# Altium schematic sheet Sheet2.SchDoc
size B; SheetNumber: 1; SheetTotal: 1
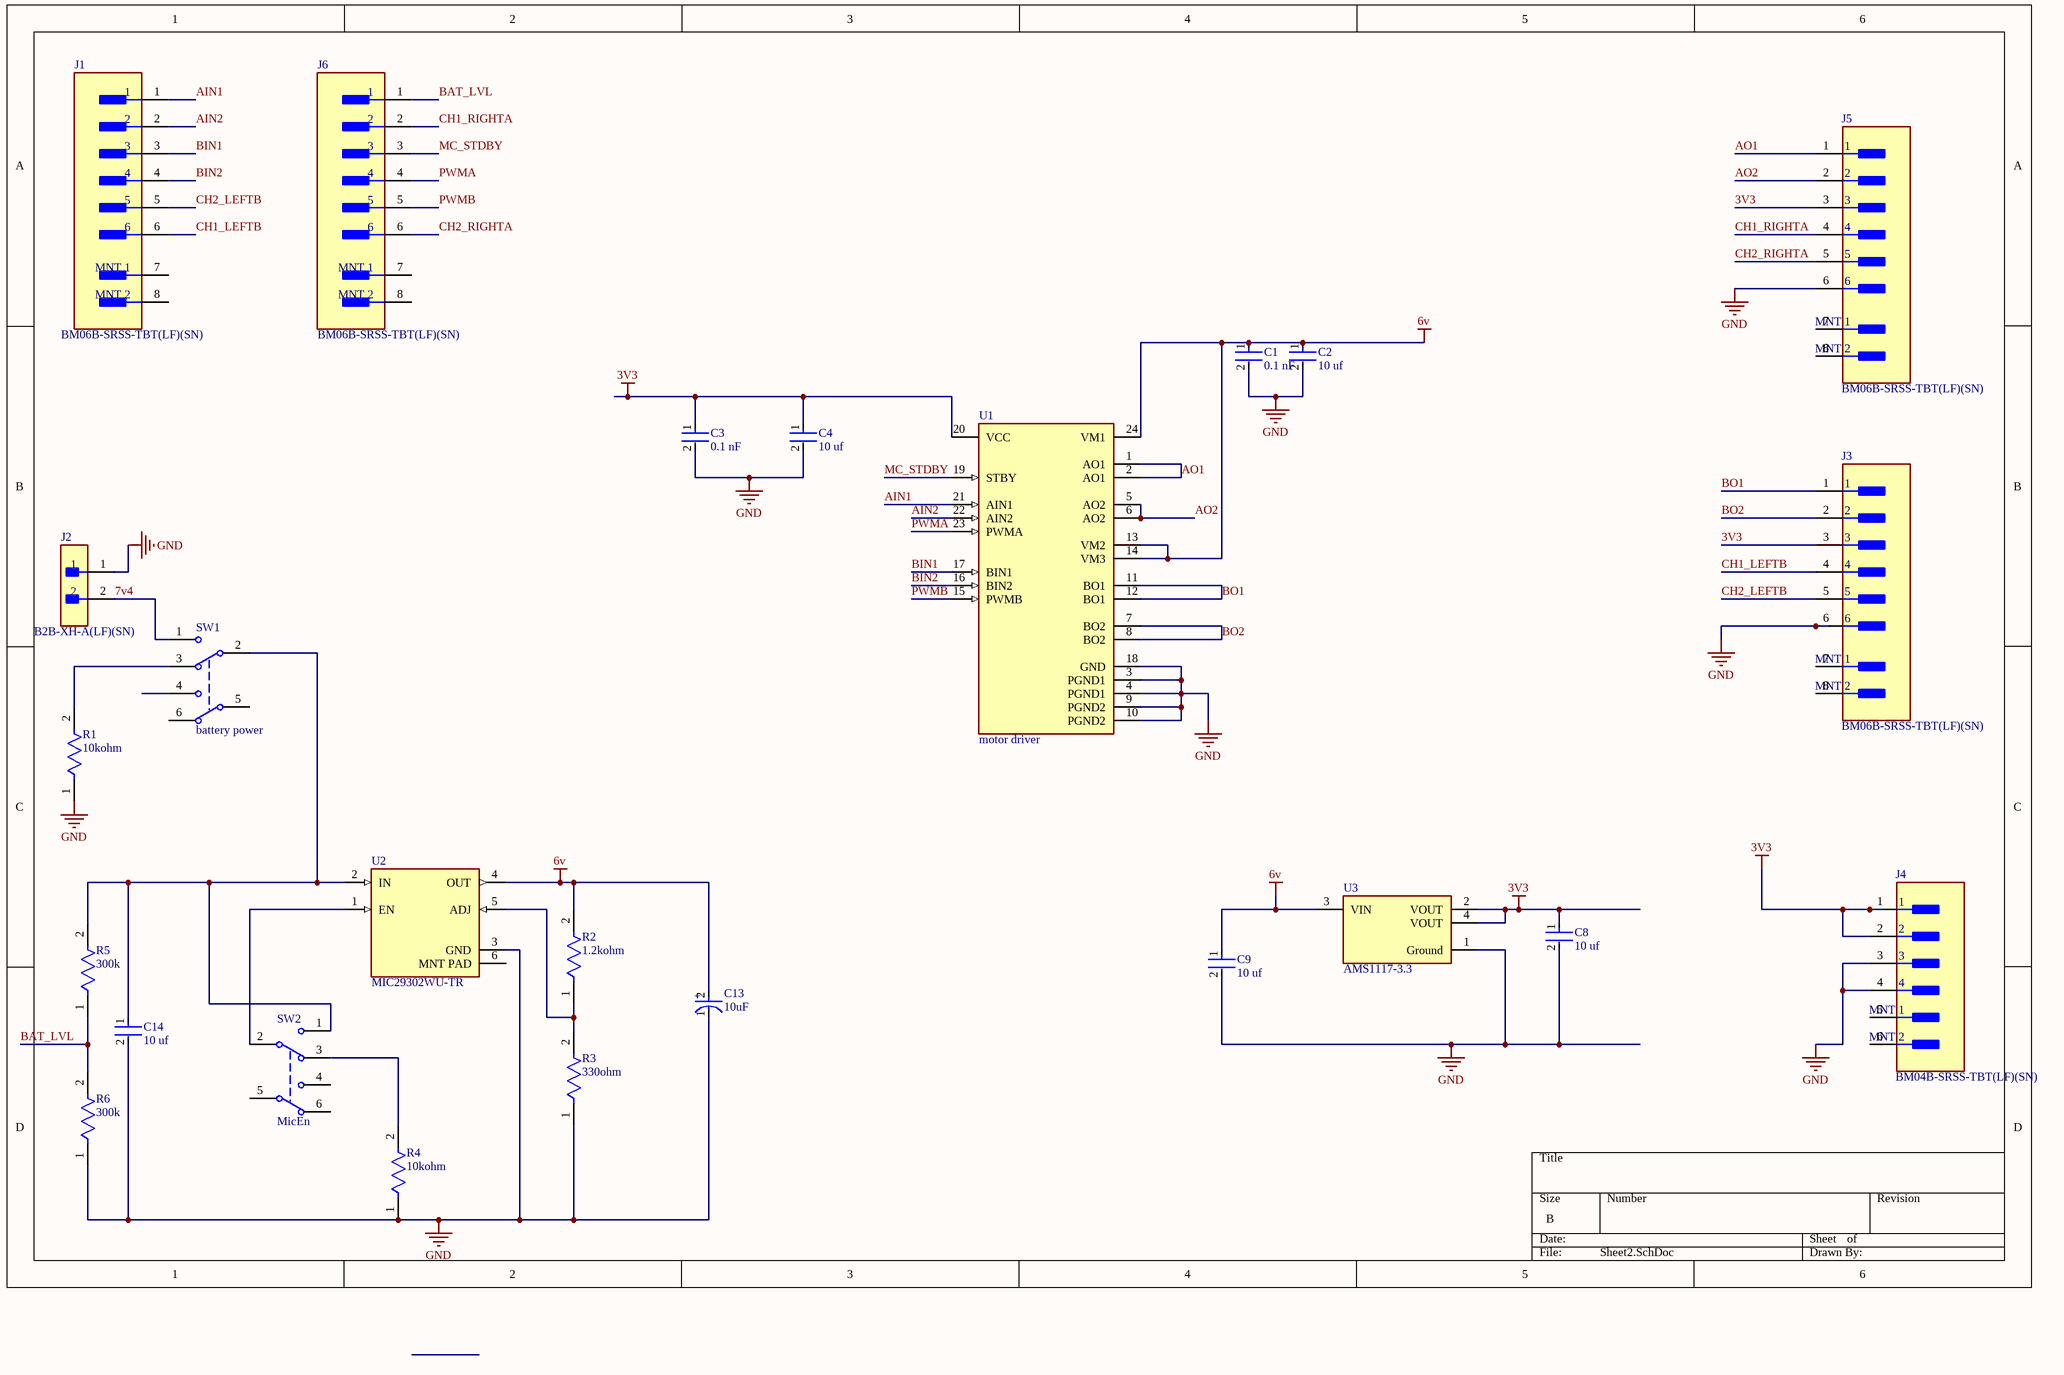
[diagram p0: Sheet2.SchDoc]

## Parts
C1  0.1 nF  [FP-CC0805-0_85-MFG]
C2  10 uf  [FP-CC0805-0_2-1_45-IPC_A]
C3  0.1 nF  [FP-CC0805-0_85-MFG]
C4  10 uf  [FP-CC0805-0_2-1_45-IPC_A]
C8  10 uf  [FP-CC0805-0_2-1_45-IPC_A]
C9  10 uf  [FP-CC0805-0_2-1_45-IPC_A]
C13  10uF  [FP-T491A105K016AT-MFG]
C14  10 uf  [FP-CC0805-0_2-1_45-IPC_A]
J1  BM06B-SRSS-TBT(LF)(SN)  [FP-BM06B-SRSS-TBT_LF_SN-MFG]
J2  B2B-XH-A(LF)(SN)  [FP-B2B-XH-A_LF_SN-MFG]
J3  BM06B-SRSS-TBT(LF)(SN)  [FP-BM06B-SRSS-TBT_LF_SN-MFG]
J4  BM04B-SRSS-TBT(LF)(SN)  [FP-BM04B-SRSS-TBT_LF_SN-MFG]
J5  BM06B-SRSS-TBT(LF)(SN)  [FP-BM06B-SRSS-TBT_LF_SN-MFG]
J6  BM06B-SRSS-TBT(LF)(SN)  [FP-BM06B-SRSS-TBT_LF_SN-MFG]
R1  10kohm  [FP-CR0805-IPC_B]
R2  1.2kohm  [FP-CR0805-IPC_B]
R3  330ohm  [FP-CR0805-IPC_B]
R4  10kohm  [FP-CR0805-IPC_B]
R5  300k  [FP-CR0805-IPC_B]
R6  300k  [FP-CR0805-IPC_B]
SW1  battery power  [452404020202]
SW2  MicEn  [452404020202]
U1  motor driver  [FP-SSOP24-P-300-0_65A-IPC_A]
U2  MIC29302WU-TR  [FP-C04-012-MFG]
U3  AMS1117-3.3  [FP-AMS1117-IPC_C]

## Nets
3V3: C3.1 C4.1 C8.1 J3.3 J4.1 J4.2 J5.3 U1.20(VCC) U3.2(VOUT) U3.4(VOUT)
6v: C1.1 C2.1 C9.1 C13.2(A) R2.2 U1.13(VM2) U1.14(VM3) U1.24(VM1) U2.4(OUT) U3.3(VIN)
GND: C1.2 C2.2 C3.2 C4.2 C8.2 C9.2 C13.1(C) C14.2 J2.1 J3.6 J4.3 J4.4 J5.6 R1.1 R3.1 R4.1 R6.1 U1.3(PGND1) U1.4(PGND1) U1.9(PGND2) U1.10(PGND2) U1.18(GND) U2.3(GND) U3.1(Ground)
7v4: J2.2 SW1.1
AIN1: J1.1 U1.21(AIN1)
AIN2: J1.2 U1.22(AIN2)
AO1: J5.1 U1.1(AO1) U1.2(AO1)
AO2: J5.2 U1.5(AO2) U1.6(AO2)
BAT_LVL: J6.1 R5.1 R6.2
BIN1: J1.3 U1.17(BIN1)
BIN2: J1.4 U1.16(BIN2)
BO1: J3.1 U1.11(BO1) U1.12(BO1)
BO2: J3.2 U1.7(BO2) U1.8(BO2)
CH1_LEFTB: J1.6 J3.4
CH1_RIGHTA: J5.4 J6.2
CH2_LEFTB: J1.5 J3.5
CH2_RIGHTA: J5.5 J6.6
MC_STDBY: J6.3 U1.19(STBY)
PWMA: J6.4 U1.23(PWMA)
PWMB: J6.5 U1.15(PWMB)
NetC14_1: C14.1 R5.2 SW1.2 SW2.1 U2.2(IN)
NetR1_2: R1.2 SW1.3
NetR2_1: R2.1 R3.2 U2.5(ADJ)
NetR4_2: R4.2 SW2.3
NetSW2_2: SW2.2 U2.1(EN)

Not connected (* = marked no-connect by the designer): J1 7(MNT_1) 8(MNT_2); J3 7(MNT_1) 8(MNT_2); J4 5(MNT_1) 6(MNT_2); J5 7(MNT_1) 8(MNT_2); J6 7(MNT_1) 8(MNT_2); SW1 4 5 6; SW2 4 5 6; U2 6(MNT_PAD)

## Notes on the sheet
- (in symbol CMP-2000-07186-2) +

## Library data of the parts
C1 C3 = CMP-2100-03606-3: CAP CER 0.1UF 50V X7R 0805; Manufacturer Part Number: CC0805KRX7R9BB104; Manufacturer: Yageo; Tolerance: 0.1; Capacitance: 100 nF; Value: 100 nF; Material: Ceramic; Device Class L1: Passive Components; ComponentLink2Description: Datasheet; Package: CC0805-0.85; Digikey Description: CAP CER 0.1UF 50V X7R 0805; Device Class L3: Ceramic Capacitors; Temperature: -30°C to +85°C; Temperature Characteristic: X7R; Voltage Rating: 50 V; Height: 0.95mm; RoHS: TRUE; Ipc Land Pattern Name: CAPC200125X85; Device Class L2: Capacitors; Category: Cap; Temperature Range Low: -30°C; Temperature Range High: +85°C; Mouser Description: Multilayer Ceramic Capacitors MLCC - SMD/SMT 100nF 50V X7R 10%; Footprint Url: http://www.yageo.com/exep/pages/download/literatures/UPY-C_GEN_24.pdf; Automotive: No; Octopart: https://octopart.com/cc0805krx7r9bb104-yageo-192993; Lead Free: Yes; ComponentLink2URL: http://www.yageo.com/documents/recent/UPY-GPHC_Y5V_6.3V-to-50V_8.pdf
C2 C4 C8 C9 C14 = CMP-1036-04922-3: CAP CER 10UF 10V X5R 0805; Tolerance: 10%; Dissipation Factor: 15%; Voltage Rating: 10V; Case/Package: 0805; Series: CC; Package Quantity: 1; Max Operating Temperature: 85°C; Min Operating Temperature: -55°C; Radiation Hardening: No; Termination: SMD/SMT; Voltage Rating (DC): 10V; Width: 0.049inch; Height: 0.85mm; Packaging: Tape and Reel; Voltage: 10V; Halogen Free: Halogen Free; Lead Free: Lead Free; Case Code (Imperial): 0805; Resistor Type: Ceramic; Length: 2mm; Construction: Flat; Mount: Surface Mount; Capacitance: 10uF; Depth: 1.25mm; Number of Pins: 2; Dielectric: X5R; RoHS Compliant: Yes; Case Code (Metric): 2012
C13 = CMP-2000-07186-2: CAP TANT 1UF 10% 16V 1206; Tolerance: 20%; Ripple Current: 87mA; Dielectric Material: Tantalum; Life (Hours): 2000Hour; Dissipation Factor: 4%; ESR (Equivalent Series Resistance): 10R; Leakage Current: 500nA; Polarity: Polar; Lead Free: Lead Free; Capacitance: 1uF; Min Operating Temperature: -55°C; Number of Pins: 2; Mount: Surface Mount; Voltage: 16V; Voltage Rating: 16V; Case Code (Imperial): 1206; Length: 3.2mm; Height: 1.6mm; Features: General Purpose; Max Operating Temperature: 125°C; Package Quantity: 1; REACH SVHC: No SVHC; Termination: SMD/SMT; Depth: 1.6mm; Width: 1.6mm; Packaging: Tape and Reel; Case Code (Metric): 3216; Case/Package: 1206; Voltage Rating (DC): 16V; Height - Seated (Max): 0.071inch
J1 J3 J5 J6 = CMP-17439-000255-1: CONN HEADER SMD 6POS 1MM; Voltage Rating: 50V; Number of Positions: 6; Current Rating: 1A; Gender: Male; Contact Resistance: 20mR; Insulation Resistance: 100MR; Mated Stacking Heights: 4.9mm; Number of Rows: 1; Contact Type: Male Pin; Pitch: 1mm; Length: 8mm; Max Operating Temperature: 85°C; Mount: Surface Mount; Material: Polyamide; Depth: 3.6mm; Housing Color: Natural; Orientation: Straight; Termination: Solder; Package Quantity: 1; Min Operating Temperature: -25°C; Contact Shape: Square; Insulation Color: Natural; Connector Type: Header; Max Voltage Rating (DC): 50V; Insulation Material: Nylon; Flammability Rating: UL94 V-0; Color: Natural; Contact Plating: Tin; Lead Free: Lead Free; Packaging: Tape and Reel; Contact Material: Copper Alloy; Series: SR; Housing Material: Polyamide; Contact Finish - Mating: TIN; Max Voltage Rating (AC): 50V; Fastening Type: Pull; Max Current Rating: 1A
J2 = CMP-2000-05888-3: CONN HEADER VERT 2POS 2.5MM; Current Rating: 3A; Voltage Rating: 250V; Number of Contacts: 2; Contact Resistance: 20mR; Wire/Cable Gauge: 22AWG; Insulation Resistance: 1GR; Connector Type: Male Pin; Packaging: Bulk; Contact Material: Brass; Lead Free: Lead Free; Orientation: Straight; Contact Plating: Tin; Max Current Rating: 3A; Termination: Solder; Fastening Type: Detent; Depth: 5.75mm; Housing Material: Polyamide; REACH SVHC: No SVHC; Series: XH; Voltage Rating (AC): 250V; Number of Positions: 2; Color: Natural; Contact Type: Male Pin; Max Voltage Rating (DC): 250V; Pitch: 2.5mm; Lead Pitch: 2.5mm; Mount: Through Hole; Max Operating Temperature: 85°C; Length: 7.4mm; Max Voltage Rating (AC): 250V; Min Operating Temperature: -25°C; Number of Rows: 1; Housing Color: White
J4 = CMP-17439-000370-1: CONN HEADER SMD 4POS 1MM; Voltage Rating: 50V; Number of Positions: 4; Pitch: 0.039inch; Mated Stacking Heights: 4.9mm; Packaging: Cut Tape; Contact Material: Copper Alloy; Lead Free: Lead Free; Contact Type: Male Pin; Fastening Type: Pull; Connector Type: Header; Contact Finish - Mating: TIN; Series: SR; Number of Rows: 1; Contact Shape: Square; Package Quantity: 1; Color: Natural; Flammability Rating: UL94 V-0; Mount: Surface Mount; Insulation Color: Natural; Termination: Solder; Contact Plating: Tin; Insulation Material: Nylon
R1 R4-R6 = CMP-07231-003873-1: Thick Film Chip Resistors 0805 10kΩ 0.125W 5% 200ppm/°C; Resistance: 10kR; Power Rating: 125mW; Voltage Rating (DC): 100V; Voltage Rating: 150V; Width: 1.25mm; Composition: Thick Film; Packaging: Tape and Reel; Number of Terminations: 2; Min Operating Temperature: -55°C; Height: 0.5mm; Temperature Coefficient: 200ppm/°C; Features: Moisture Resistant; Termination: SMD/SMT; Case Code (Imperial): 0805; Package Quantity: 1; Radiation Hardening: No; Military Standard: Not; Thickness: 508um; Depth: 1.25mm; Tolerance: 5%; Contact Plating: Tin; Number of Pins: 2; Length: 2mm; Max Power Dissipation: 125mW; Mount: Surface Mount; Case Code (Metric): 2012; Case/Package: 0805; REACH SVHC: No SVHC; Max Operating Temperature: 155°C
R2 = CMP-07231-005482-1: Thick Film Chip Resistors 0805 1kΩ 0.125W 1% 100ppm/°C; Max Power Dissipation: 125mW; Voltage Rating: 150V; Resistance: 1kR; Package Quantity: 1; Contact Plating: Tin; Length: 2mm; Number of Terminations: 2; Max Operating Temperature: 155°C; Depth: 1.25mm; REACH SVHC: No SVHC; Case Code (Imperial): 0805; Termination: SMD/SMT; Min Operating Temperature: -55°C; Case Code (Metric): 2012; Width: 1.25mm; Packaging: Tape and Reel; Case/Package: 0805; Height: 0.5mm; Radiation Hardening: No; Thickness: 508um; Temperature Coefficient: 100ppm/°C; Mount: Surface Mount; Features: Moisture Resistant; Voltage Rating (DC): 150V; Composition: Thick Film; Power Rating: 125mW; Number of Pins: 2; Tolerance: 1%
R3 = CMP-1013-00454-2: Thick Film Chip Resistors 0805 330Ω 0.125W 1% 100ppm/°C; Voltage Rating: 150V; Resistance: 330R; Power Rating: 125mW; Case Code (Imperial): 0805; Packaging: Tape and Reel; REACH SVHC: No SVHC; Min Operating Temperature: -55°C; Height: 0.5mm; Tolerance: 1%; Radiation Hardening: No; Depth: 1.25mm; Mount: Surface Mount; Length: 2mm; Voltage Rating (DC): 150V; Contact Plating: Tin; Temperature Coefficient: 100ppm/°C; Thickness: 508um; Max Operating Temperature: 155°C; Termination: SMD/SMT; Military Standard: Not; Case Code (Metric): 2012; Width: 1.25mm; Package Quantity: 5000; Case/Package: 0805; Composition: Thick Film
SW1 SW2 = CMP-03913-99472345-1: 452404020202 Slide Switch, Dpdt, 0.3A, 6Vdc, Tht Rohs Compliant: Yes; Insulation Resistance: 100MΩ; Voltage Rating: 6V; Current Rating: 300mA; Min Operating Temperature: -40°C; Contact Plating: Silver; Max Operating Temperature: 85°C; Packaging: Bulk; NexarPartId: 99472345
U1 = CMP-2100-03693-4: IC MOTOR DRIVER 2.7V-5.5V 24SSOP; Logic Function: AND GATE; Interface: Parallel; Operating Supply Voltage: 3V; Max Supply Voltage: 5.5V; Output Current: 1A; Min Supply Voltage: 2.7V; Number of Outputs: 2; Packaging: Tape and Reel; Mount: Surface Mount; Number of Pins: 24; Min Operating Temperature: -20°C; Case/Package: SSOP; Series: -; Max Operating Temperature: 85°C; Package Quantity: 1
U2 = CMP-06324-000007-1: IC REG LINEAR POS ADJ 3A TO263-5; Manufacturer: Microchip; Output Voltage: 3.3-12V; Output Type: AdjustableProgrammable; Max Junction Temp: +125°C; Standoff Height: 0mm; Accuracy Percentage: 1%; Max Supply Voltage: 26V; Nominal Supply Current: 10-37mA; Number Of Outputs: 1; Dropout Voltage: 370mV; Min Supply Voltage: 2.25V; ComponentLink2URL: http://ww1.microchip.com/downloads/en/DeviceDoc/MIC2915x-30x-50x-75x-High-Current-Low-Dropout-Regulators-DS20005685B.pdf; Device Class L1: Integrated Circuits (ICs); Digikey Description: IC REG LINEAR POS ADJ 3A TO263-5; Device Class L2: Power Management ICs; Lead Free: Yes; Mouser Description: LDO Voltage Regulators; Package: C04-012; Temperature: -40°C to +125°C; ComponentLink2Description: Datasheet; Temperature Range High: +125°C; Automotive: No; Device Class L3: Voltage Regulators - Linear; Category: IC; Temperature Range Low: -40°C; RoHS: TRUE; Output Current: 3A; Octopart: https://octopart.com/mic29302wu-tr-microchip-66801318; Manufacturer Part Number: MIC29302WU-TR; Height: 0.2inch
U3 = CMP-209535-000001-1: LDO Voltage Regulators 1A, 3.3V; Manufacturer: Advanced Monolithic Systems; Dropout Voltage: 1.1V; Output Type: Fixed; Nominal Supply Current: 5mA; Max Power Dissipation: 1.2W; Max Supply Voltage: 15V; Number Of Outputs: 1; Standoff Height: 0.64mm; Max Junction Temp: +125°C; Height: 1.8mm; Package: AMS1117; Device Class L2: Power Management ICs; ComponentLink2Description: Datasheet; ComponentLink2URL: http://www.advanced-monolithic.com/pdf/ds1117.pdf; Category: IC; RoHS: TRUE; Automotive: No; Device Class L1: Integrated Circuits (ICs); Output Current: 1A; Device Class L3: Voltage Regulators - Linear; Temperature: -40°C to +125°C; Output Voltage: 3.3V; Manufacturer Part Number: AMS1117-3.3; Temperature Range Low: -40°C; Octopart: https://octopart.com/ams1117-3.3-advanced+monolithic+systems-25899300; Lead Free: Yes; Ipc Land Pattern Name: SOT229P700X180-4; Temperature Range High: +125°C